# Altium schematic sheet Sheet1.SchDoc
size A
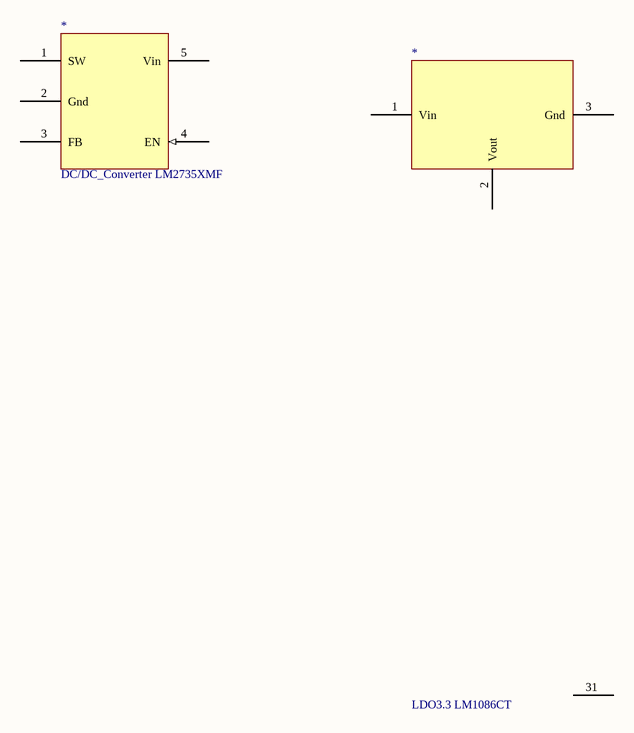
[diagram p0: Sheet1.SchDoc]

## Parts
(Parts that share a designator on the sheet are numbered #1, #2 ... from top to bottom, then left to right.)
*#1  DC/DC_Converter LM2735XMF
*#2  LDO3.3 LM1086CT

## Nets

Not connected (* = marked no-connect by the designer): *#1 1(SW) 2(Gnd) 3(FB) 4(EN) 5(Vin); *#2 1(Vin) 2(Vout) 3(Gnd) 31